# EAGLE design pepper-rev1 (EAGLE 9.3.2)
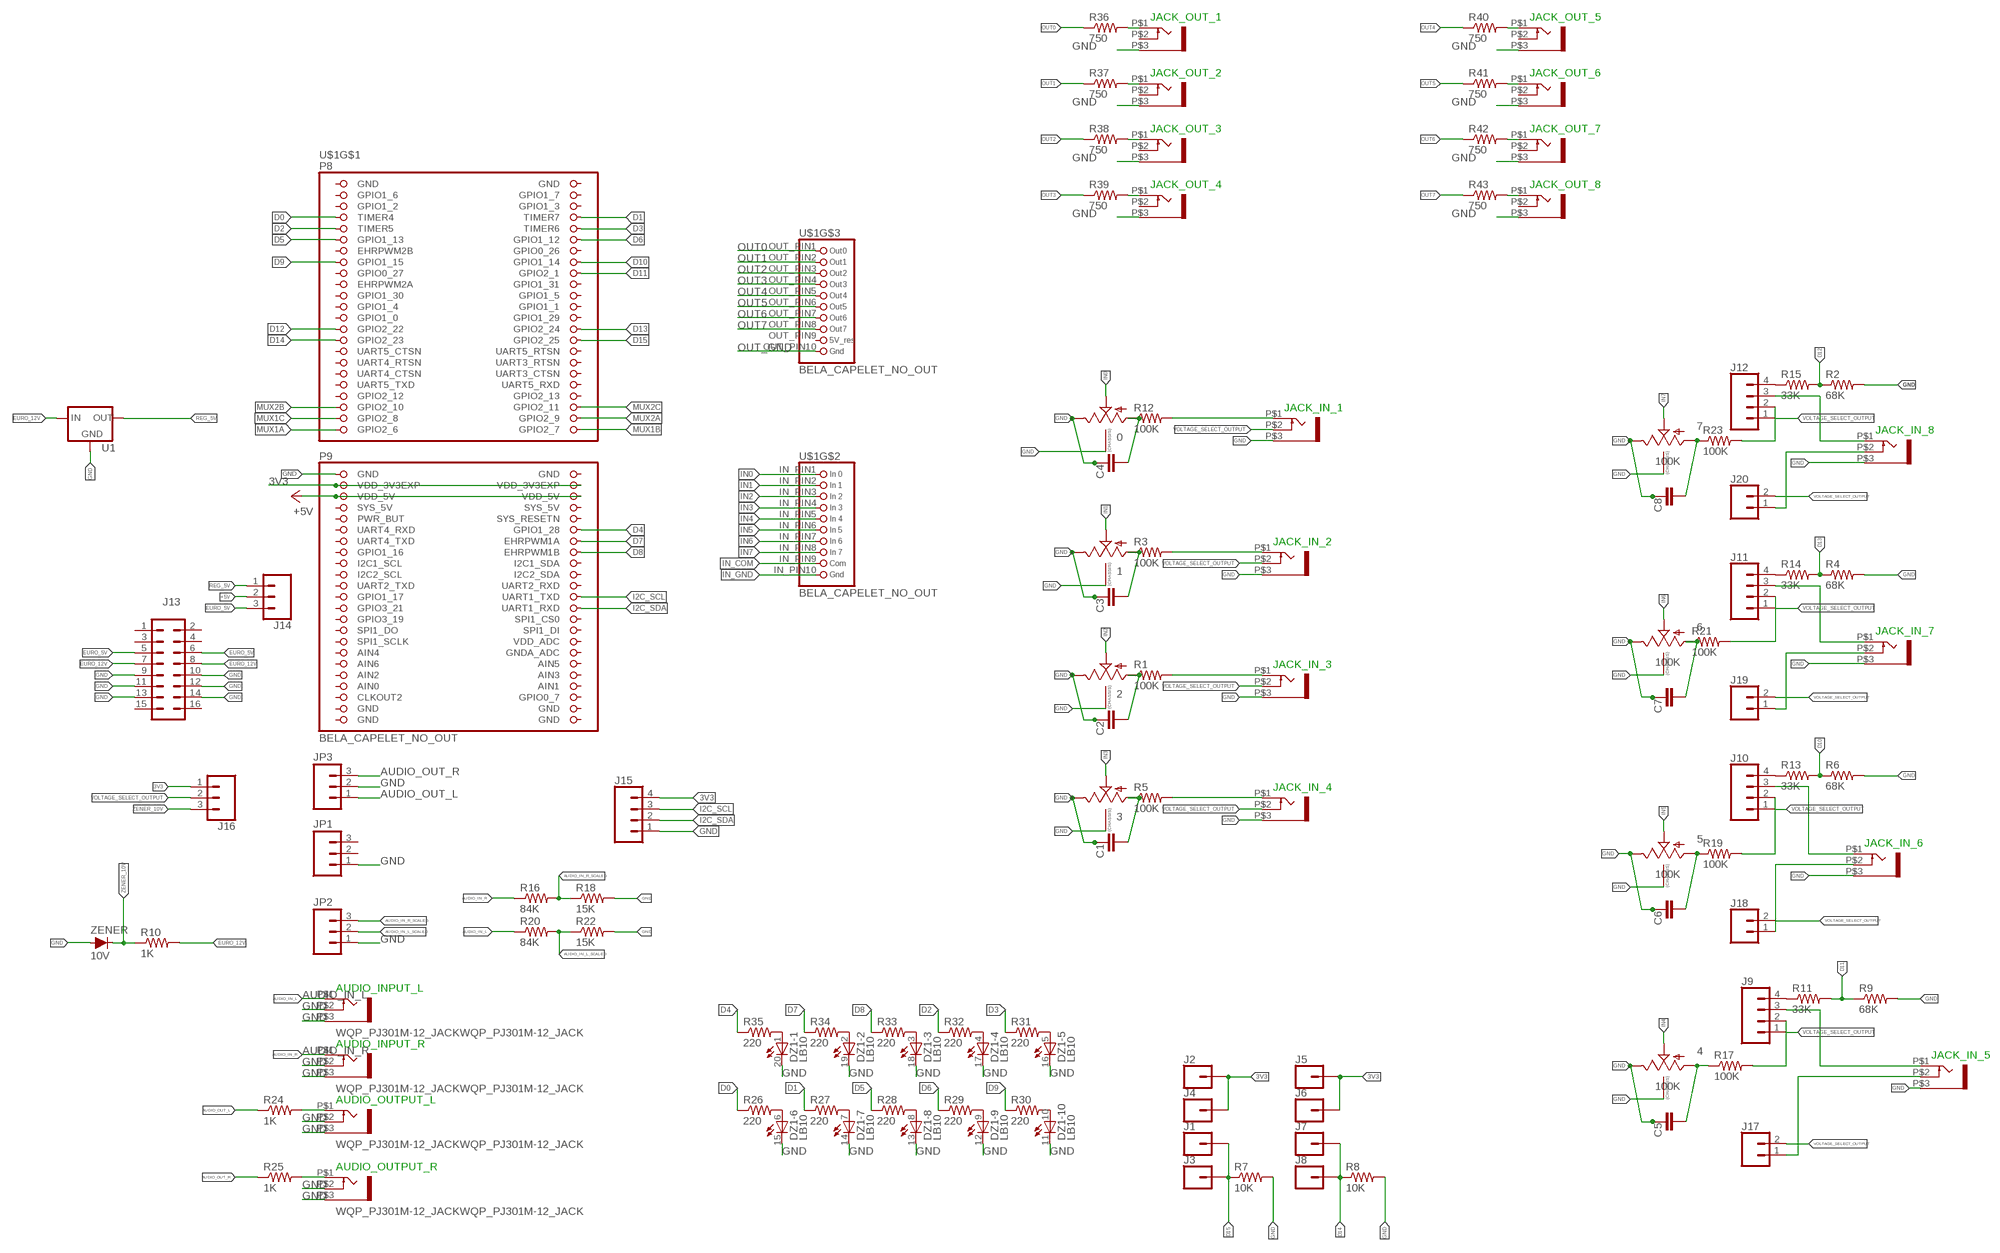
[diagram p0: schematic, sheet 1]

## Parts
0  9MM_SNAP-IN_POT_CHASSIS  [9MM_SNAP-IN_POT]
1  9MM_SNAP-IN_POT_CHASSIS  [9MM_SNAP-IN_POT]
2  9MM_SNAP-IN_POT_CHASSIS  [9MM_SNAP-IN_POT]
3  9MM_SNAP-IN_POT_CHASSIS  [9MM_SNAP-IN_POT]
4  100K  9MM_SNAP-IN_POT_CHASSIS  [9MM_SNAP-IN_POT]
5  100K  9MM_SNAP-IN_POT_CHASSIS  [9MM_SNAP-IN_POT]
6  100K  9MM_SNAP-IN_POT_CHASSIS  [9MM_SNAP-IN_POT]
7  100K  9MM_SNAP-IN_POT_CHASSIS  [9MM_SNAP-IN_POT]
AUDIO_INPUT_L  WQP_PJ301M-12_JACKWQP_PJ301M-12_JACK  [JACK-3.5]
AUDIO_INPUT_R  WQP_PJ301M-12_JACKWQP_PJ301M-12_JACK  [JACK-3.5]
AUDIO_OUTPUT_L  WQP_PJ301M-12_JACKWQP_PJ301M-12_JACK  [JACK-3.5]
AUDIO_OUTPUT_R  WQP_PJ301M-12_JACKWQP_PJ301M-12_JACK  [JACK-3.5]
C1  CAPPTH  [CAP-PTH-SMALL]
C2  CAPPTH  [CAP-PTH-SMALL]
C3  CAPPTH  [CAP-PTH-SMALL]
C4  CAPPTH  [CAP-PTH-SMALL]
C5  CAPPTH  [CAP-PTH-SMALL]
C6  CAPPTH  [CAP-PTH-SMALL]
C7  CAPPTH  [CAP-PTH-SMALL]
C8  CAPPTH  [CAP-PTH-SMALL]
DZ1  LB10  [LB10]
J1  CONN_01  [1X01]
J2  CONN_01  [1X01]
J3  CONN_01  [1X01]
J4  CONN_01  [1X01]
J5  CONN_01  [1X01]
J6  CONN_01  [1X01]
J7  CONN_01  [1X01]
J8  CONN_01  [1X01]
J9  CONN_04PTH  [1X04]
J10  CONN_04PTH  [1X04]
J11  CONN_04PTH  [1X04]
J12  CONN_04PTH  [1X04]
J13  2X6 FEMALE  CONN_08X2  [2X8]
J14  CONN_03  [1X03]
J15  CONN_04PTH  [1X04]
J16  CONN_03  [1X03]
J17  CONN_02  [1X02]
J18  CONN_02  [1X02]
J19  CONN_02  [1X02]
J20  CONN_02  [1X02]
JACK_IN_1  WQP_PJ301M-12_JACKWQP_PJ301M-12_JACK  [JACK-3.5]
JACK_IN_2  WQP_PJ301M-12_JACKWQP_PJ301M-12_JACK  [JACK-3.5]
JACK_IN_3  WQP_PJ301M-12_JACKWQP_PJ301M-12_JACK  [JACK-3.5]
JACK_IN_4  WQP_PJ301M-12_JACKWQP_PJ301M-12_JACK  [JACK-3.5]
JACK_IN_5  WQP_PJ301M-12_JACKWQP_PJ301M-12_JACK  [JACK-3.5]
JACK_IN_6  WQP_PJ301M-12_JACKWQP_PJ301M-12_JACK  [JACK-3.5]
JACK_IN_7  WQP_PJ301M-12_JACKWQP_PJ301M-12_JACK  [JACK-3.5]
JACK_IN_8  WQP_PJ301M-12_JACKWQP_PJ301M-12_JACK  [JACK-3.5]
JACK_OUT_1  WQP_PJ301M-12_JACKWQP_PJ301M-12_JACK  [JACK-3.5]
JACK_OUT_2  WQP_PJ301M-12_JACKWQP_PJ301M-12_JACK  [JACK-3.5]
JACK_OUT_3  WQP_PJ301M-12_JACKWQP_PJ301M-12_JACK  [JACK-3.5]
JACK_OUT_4  WQP_PJ301M-12_JACKWQP_PJ301M-12_JACK  [JACK-3.5]
JACK_OUT_5  WQP_PJ301M-12_JACKWQP_PJ301M-12_JACK  [JACK-3.5]
JACK_OUT_6  WQP_PJ301M-12_JACKWQP_PJ301M-12_JACK  [JACK-3.5]
JACK_OUT_7  WQP_PJ301M-12_JACKWQP_PJ301M-12_JACK  [JACK-3.5]
JACK_OUT_8  WQP_PJ301M-12_JACKWQP_PJ301M-12_JACK  [JACK-3.5]
JP1  M03PTH  [1X03@1]
JP2  M03PTH  [1X03@1]
JP3  M03PTH  [1X03@1]
R1  100K  RESISTORAXIAL-0.3  [AXIAL-0.3]
R2  68K  RESISTORAXIAL-0.3  [AXIAL-0.3]
R3  100K  RESISTORAXIAL-0.3  [AXIAL-0.3]
R4  68K  RESISTORAXIAL-0.3  [AXIAL-0.3]
R5  100K  RESISTORAXIAL-0.3  [AXIAL-0.3]
R6  68K  RESISTORAXIAL-0.3  [AXIAL-0.3]
R7  10K  RESISTORAXIAL-0.3  [AXIAL-0.3]
R8  10K  RESISTORAXIAL-0.3  [AXIAL-0.3]
R9  68K  RESISTORAXIAL-0.3  [AXIAL-0.3]
R10  1K  RESISTORAXIAL-0.3  [AXIAL-0.3]
R11  33K  RESISTORAXIAL-0.3  [AXIAL-0.3]
R12  100K  RESISTORAXIAL-0.3  [AXIAL-0.3]
R13  33K  RESISTORAXIAL-0.3  [AXIAL-0.3]
R14  33K  RESISTORAXIAL-0.3  [AXIAL-0.3]
R15  33K  RESISTORAXIAL-0.3  [AXIAL-0.3]
R16  84K  RESISTORAXIAL-0.3  [AXIAL-0.3]
R17  100K  RESISTORAXIAL-0.3  [AXIAL-0.3]
R18  15K  RESISTORAXIAL-0.3  [AXIAL-0.3]
R19  100K  RESISTORAXIAL-0.3  [AXIAL-0.3]
R20  84K  RESISTORAXIAL-0.3  [AXIAL-0.3]
R21  100K  RESISTORAXIAL-0.3  [AXIAL-0.3]
R22  15K  RESISTORAXIAL-0.3  [AXIAL-0.3]
R23  100K  RESISTORAXIAL-0.3  [AXIAL-0.3]
R24  1K  RESISTORAXIAL-0.3  [AXIAL-0.3]
R25  1K  RESISTORAXIAL-0.3  [AXIAL-0.3]
R26  220  RESISTORAXIAL-0.3  [AXIAL-0.3]
R27  220  RESISTORAXIAL-0.3  [AXIAL-0.3]
R28  220  RESISTORAXIAL-0.3  [AXIAL-0.3]
R29  220  RESISTORAXIAL-0.3  [AXIAL-0.3]
R30  220  RESISTORAXIAL-0.3  [AXIAL-0.3]
R31  220  RESISTORAXIAL-0.3  [AXIAL-0.3]
R32  220  RESISTORAXIAL-0.3  [AXIAL-0.3]
R33  220  RESISTORAXIAL-0.3  [AXIAL-0.3]
R34  220  RESISTORAXIAL-0.3  [AXIAL-0.3]
R35  220  RESISTORAXIAL-0.3  [AXIAL-0.3]
R36  750  RESISTORAXIAL-0.3  [AXIAL-0.3]
R37  750  RESISTORAXIAL-0.3  [AXIAL-0.3]
R38  750  RESISTORAXIAL-0.3  [AXIAL-0.3]
R39  750  RESISTORAXIAL-0.3  [AXIAL-0.3]
R40  750  RESISTORAXIAL-0.3  [AXIAL-0.3]
R41  750  RESISTORAXIAL-0.3  [AXIAL-0.3]
R42  750  RESISTORAXIAL-0.3  [AXIAL-0.3]
R43  750  RESISTORAXIAL-0.3  [AXIAL-0.3]
U1  V_REG_78XXSINK  [TO220-IGO]
U$1  BELA_CAPELET_NO_OUT  [BELA_CAPELET_NO_OUTLINE]
ZENER  10V  DIODE-KIT2  [DIODE-1N4001-KIT]

## Nets
1: JACK_IN_3.P$1 R1.P$2
2: JACK_IN_2.P$1 R3.P$2
3: JACK_IN_1.P$1 R12.P$2
3V3: J2.1 J4.1 J5.1 J6.1 J15.4 J16.1 U$1.49(VDD_3V3EXP) U$1.50(VDD_3V3EXP)
4: JACK_IN_4.P$1 R5.P$2
+5V: J14.2 U$1.51(VDD_5V) U$1.52(VDD_5V)
AUDIO_IN_L: AUDIO_INPUT_L.P$1 R20.P$1
AUDIO_IN_L_SCALED: JP2.2 R20.P$2 R22.P$1
AUDIO_IN_R: AUDIO_INPUT_R.P$1 R16.P$1
AUDIO_IN_R_SCALED: JP2.3 R16.P$2 R18.P$1
AUDIO_OUT_L: JP3.1 R24.P$1
AUDIO_OUT_R: JP3.3 R25.P$1
D0: R26.P$1 U$1.7(TIMER4)
D1: R27.P$1 U$1.8(TIMER7)
D2: R32.P$1 U$1.9(TIMER5)
D3: R31.P$1 U$1.10(TIMER6)
D4: R35.P$1 U$1.58(GPIO1_28)
D5: R28.P$1 U$1.11(GPIO1_13)
D6: R29.P$1 U$1.12(GPIO1_12)
D7: R34.P$1 U$1.60(EHRPWM1A)
D8: R33.P$1 U$1.62(EHRPWM1B)
D9: R30.P$1 U$1.15(GPIO1_15)
D10: R6.P$1 R13.P$2 U$1.16(GPIO1_14)
D11: R9.P$1 R11.P$2 U$1.18(GPIO2_1)
D12: R2.P$1 R15.P$2 U$1.27(GPIO2_22)
D13: R4.P$1 R14.P$2 U$1.28(GPIO2_24)
D14: J7.1 J8.1 R8.P$1 U$1.29(GPIO2_23)
D15: J1.1 J3.1 R7.P$1 U$1.30(GPIO2_25)
EURO_5V: J13.5 J13.6 J14.3
EURO_12V: J13.7 J13.8 R10.P$2 U1.IN
GND: 0.3(E) 0.CHASSIS1 0.CHASSIS2 1.3(E) 1.CHASSIS1 1.CHASSIS2 2.3(E) 2.CHASSIS1 2.CHASSIS2 3.3(E) 3.CHASSIS1 3.CHASSIS2 4.3(E) 4.CHASSIS1 4.CHASSIS2 5.3(E) 5.CHASSIS1 5.CHASSIS2 6.3(E) 6.CHASSIS1 6.CHASSIS2 7.3(E) 7.CHASSIS1 7.CHASSIS2 AUDIO_INPUT_L.P$2 AUDIO_INPUT_L.P$3 AUDIO_INPUT_R.P$2 AUDIO_INPUT_R.P$3 AUDIO_OUTPUT_L.P$2 AUDIO_OUTPUT_L.P$3 AUDIO_OUTPUT_R.P$2 AUDIO_OUTPUT_R.P$3 C1.1 C2.1 C3.1 C4.1 C5.1 C6.1 C7.1 C8.1 DZ1.11(-10:C) DZ1.12(-9:C) DZ1.13(-8:C) DZ1.14(-7:C) DZ1.15(-6:C) DZ1.16(-5:C) DZ1.17(-4:C) DZ1.18(-3:C) DZ1.19(-2:C) DZ1.20(-1:C) J13.9 J13.10 J13.11 J13.12 J13.13 J13.14 J15.1 JACK_IN_1.P$3 JACK_IN_2.P$3 JACK_IN_3.P$3 JACK_IN_4.P$3 JACK_IN_5.P$3 JACK_IN_6.P$3 JACK_IN_7.P$3 JACK_IN_8.P$3 JACK_OUT_1.P$3 JACK_OUT_2.P$3 JACK_OUT_3.P$3 JACK_OUT_4.P$3 JACK_OUT_5.P$3 JACK_OUT_6.P$3 JACK_OUT_7.P$3 JACK_OUT_8.P$3 JP1.1 JP2.1 JP3.2 R2.P$2 R4.P$2 R6.P$2 R7.P$2 R8.P$2 R9.P$2 R18.P$2 R22.P$2 U1.GND U$1.47(GND) ZENER.A
I2C_SCL: J15.3 U$1.70(UART1_TXD)
I2C_SDA: J15.2 U$1.72(UART1_RXD)
IN0: 0.2(S) U$1.IN_PIN1
IN1: 1.2(S) U$1.IN_PIN2
IN2: 2.2(S) U$1.IN_PIN3
IN3: 3.2(S) U$1.IN_PIN4
IN4: 4.2(S) U$1.IN_PIN5
IN5: 5.2(S) U$1.IN_PIN6
IN6: 6.2(S) U$1.IN_PIN7
IN7: 7.2(S) U$1.IN_PIN8
IN_COM: U$1.IN_PIN9
IN_GND: U$1.IN_PIN10
MUX1A: U$1.45(GPIO2_6)
MUX1B: U$1.46(GPIO2_7)
MUX1C: U$1.43(GPIO2_8)
MUX2A: U$1.44(GPIO2_9)
MUX2B: U$1.41(GPIO2_10)
MUX2C: U$1.42(GPIO2_11)
N$2: J10.3 JACK_IN_6.P$1
N$3: DZ1.6(-6:A) R26.P$2
N$4: DZ1.7(-7:A) R27.P$2
N$5: DZ1.8(-8:A) R28.P$2
N$6: DZ1.9(-9:A) R29.P$2
N$7: DZ1.10(-10:A) R30.P$2
N$8: DZ1.5(-5:A) R31.P$2
N$9: DZ1.4(-4:A) R32.P$2
N$10: DZ1.3(-3:A) R33.P$2
N$11: DZ1.2(-2:A) R34.P$2
N$12: DZ1.1(-1:A) R35.P$2
N$13: 1.1(A) C3.2 R3.P$1
N$14: J12.2 R23.P$2
N$15: J11.3 JACK_IN_7.P$1
N$16: 6.1(A) C7.2 R21.P$1
N$17: J9.2 R17.P$2
N$18: 5.1(A) C6.2 R19.P$1
N$19: J9.3 JACK_IN_5.P$1
N$20: J12.3 JACK_IN_8.P$1
N$21: 4.1(A) C5.2 R17.P$1
N$22: J10.4 R13.P$1
N$23: J12.4 R15.P$1
N$24: J9.4 R11.P$1
N$25: J10.2 R19.P$2
N$26: J11.2 R21.P$2
N$27: J11.4 R14.P$1
N$28: AUDIO_OUTPUT_R.P$1 R25.P$2
N$29: AUDIO_OUTPUT_L.P$1 R24.P$2
N$30: J17.1 JACK_IN_5.P$2
N$31: JACK_OUT_1.P$1 R36.P$2
N$32: J19.1 JACK_IN_7.P$2
N$33: J18.1 JACK_IN_6.P$2
N$34: J20.1 JACK_IN_8.P$2
N$35: JACK_OUT_2.P$1 R37.P$2
N$36: JACK_OUT_3.P$1 R38.P$2
N$37: JACK_OUT_4.P$1 R39.P$2
N$38: JACK_OUT_5.P$1 R40.P$2
N$39: JACK_OUT_6.P$1 R41.P$2
N$40: JACK_OUT_7.P$1 R42.P$2
N$41: JACK_OUT_8.P$1 R43.P$2
OUT0: R36.P$1 U$1.OUT_PIN1
OUT1: R37.P$1 U$1.OUT_PIN2
OUT2: R38.P$1 U$1.OUT_PIN3
OUT3: R39.P$1 U$1.OUT_PIN4
OUT4: R40.P$1 U$1.OUT_PIN5
OUT5: R41.P$1 U$1.OUT_PIN6
OUT6: R42.P$1 U$1.OUT_PIN7
OUT7: R43.P$1 U$1.OUT_PIN8
OUT_GND: U$1.OUT_PIN10
POT_IN1: 0.1(A) C4.2 R12.P$1
POT_IN3: 2.1(A) C2.2 R1.P$1
POT_IN4: 3.1(A) C1.2 R5.P$1
POT_IN8: 7.1(A) C8.2 R23.P$1
REG_5V: J14.1 U1.OUT
VOLTAGE_SELECT_OUTPUT: J9.1 J10.1 J11.1 J12.1 J16.2 J17.2 J18.2 J19.2 J20.2 JACK_IN_1.P$2 JACK_IN_2.P$2 JACK_IN_3.P$2 JACK_IN_4.P$2
ZENER_10V: J16.3 R10.P$1 ZENER.C
Unconnected: J13.1 J13.2 J13.3 J13.4 J13.15 J13.16 JACK_OUT_1.P$2 JACK_OUT_2.P$2 JACK_OUT_3.P$2 JACK_OUT_4.P$2 JACK_OUT_5.P$2 JACK_OUT_6.P$2 JACK_OUT_7.P$2 JACK_OUT_8.P$2 JP1.2 JP1.3 U$1.3(GPIO1_6) U$1.4(GPIO1_7) U$1.5(GPIO1_2) U$1.6(GPIO1_3) U$1.13(EHRPWM2B) U$1.14(GPIO0_26) U$1.17(GPIO0_27) U$1.19(EHRPWM2A) U$1.20(GPIO1_31) U$1.21(GPIO1_30) U$1.22(GPIO1_5) U$1.23(GPIO1_4) U$1.24(GPIO1_1) U$1.25(GPIO1_0) U$1.26(GPIO1_29) U$1.31(UART5_CTSN) U$1.32(UART5_RTSN) U$1.33(UART4_RTSN) U$1.34(UART3_RTSN) U$1.35(UART4_CTSN) U$1.36(UART3_CTSN) U$1.37(UART5_TXD) U$1.38(UART5_RXD) U$1.39(GPIO2_12) U$1.40(GPIO2_13) U$1.54(SYS_5V) U$1.55(PWR_BUT) U$1.56(SYS_RESETN) U$1.57(UART4_RXD) U$1.59(UART4_TXD) U$1.61(GPIO1_16) U$1.63(I2C1_SCL) U$1.64(I2C1_SDA) U$1.65(I2C2_SCL) U$1.66(I2C2_SDA) U$1.67(UART2_TXD) U$1.68(UART2_RXD) U$1.69(GPIO1_17) U$1.71(GPIO3_21) U$1.73(GPIO3_19) U$1.74(SPI1_CS0) U$1.75(SPI1_DO) U$1.76(SPI1_DI) U$1.77(SPI1_SCLK) U$1.78(VDD_ADC) U$1.79(AIN4) U$1.80(GNDA_ADC) U$1.81(AIN6) U$1.82(AIN5) U$1.83(AIN2) U$1.84(AIN3) U$1.86(AIN1) U$1.87(CLKOUT2) U$1.88(GPIO0_7) U$1.OUT_PIN9

## Power pins joined to a net without a drawn wire
AIN0: U$1.85(AIN0)
GND: U$1.1(GND) U$1.2(GND) U$1.48(GND) U$1.89(GND) U$1.90(GND) U$1.91(GND) U$1.92(GND)
SYS_5V: U$1.53(SYS_5V)

## Library data of the parts
0 1-7 = MusicThingModular:9MM_SNAP-IN_POT_CHASSIS: 9mm vertical snap-in pot, Alpha / Panasonic style, with a connection to the metal chassis for grounding
AUDIO_INPUT_L AUDIO_INPUT_R AUDIO_OUTPUT_L AUDIO_OUTPUT_R JACK_IN_1-JACK_IN_8 JACK_OUT_1-JACK_OUT_8 = thonkiconn_eagle_v5:WQP_PJ301M-12_JACK: 3.5mm Vertical Jack from Thonk.co.uk
C1-C8 = SparkFun-Capacitors:CAP: Capacitor Standard 0603 ceramic capacitor, and 0.1" leaded capacitor.
DZ1 = led:LB10: LED BLOCK 10-LED bar graph, DIL, Siemens
J1-J8 = SparkFun-Connectors:CONN_01: Single connection point. Often used as Generic Header-pin footprint for 0.1 inch spaced/style header connections On any of the 0.1 inch spaced packages, you can populate with these: Break Away Headers - Straight <https://www.sparkfun.com/products/116> (PRT-00116) Break Away Male Headers - Right Angle <https://www.sparkfun.com/products/553> (PRT-00553) Female Headers <https://www.sparkfun.com/products/115> (PRT-00115) Break Away Headers - Machine Pin <https://www.sparkfun.com/products/117> (PRT-00117) Break Away Female Headers - Swiss Machine Pin <https://www.sparkfun.com/products/743> (PRT-00743) This device is also useful as a general connection point to wire up your design to another part of your project. Our various solder wires solder well into these plated through hole pads. Hook-Up Wire - Assortment (Stranded, 22 AWG) <https://www.sparkfun.com/products/11375> (PRT-11375) Hook-Up Wire - Assortment (Solid Core, 22 AWG) <https://www.sparkfun.com/products/11367> (PRT-11367) View the entire wire category on our website here <https://www.sparkfun.com/categories/141> Special notes: SMTSO-256-ET is a "flush mount" nut for a 4-40 screw. We mostly use this on specialty testbeds; it is a nice way to connect hardware to your PCB at an adjustable hieght. Also note, the SNAP packages are for using a snappable style connector. We sell a baggie of snaps and they are also used on two LilyPad designs: Snap Assortment - 30 pack (male and female) <https://www.sparkfun.com/products/11347> (DEV-11347) LilyPad Arduino SimpleSnap <https://www.sparkfun.com/products/10941> (DEV-10941) LilyPad SimpleSnap Protoboard <https://www.sparkfun.com/products/10940> (DEV-10940)
J9-J12 J15 = SparkFun-Connectors:CONN_04: Multi connection point. Often used as Generic Header-pin footprint for 0.1 inch spaced/style header connections On any of the 0.1 inch spaced packages, you can populate with these: Break Away Headers - Straight <https://www.sparkfun.com/products/116> (PRT-00116) Break Away Male Headers - Right Angle <https://www.sparkfun.com/products/553> (PRT-00553) Female Headers <https://www.sparkfun.com/products/115> (PRT-00115) Break Away Headers - Machine Pin <https://www.sparkfun.com/products/117> (PRT-00117) Break Away Female Headers - Swiss Machine Pin <https://www.sparkfun.com/products/743> (PRT-00743) For SCREWTERMINALS and SPRING TERMINALS visit here: Screw Terimnals on SparkFun.com <https://www.sparkfun.com/search/results?term=Screw+Terminals> (5mm/3.5mm/2.54mm spacing) This device is also useful as a general connection point to wire up your design to another part of your project. Our various solder wires solder well into these plated through hole pads. Hook-Up Wire - Assortment (Stranded, 22 AWG) <https://www.sparkfun.com/products/11375> (PRT-11375) Hook-Up Wire - Assortment (Solid Core, 22 AWG) <https://www.sparkfun.com/products/11367> (PRT-11367) View the entire wire category on our website here <https://www.sparkfun.com/categories/141> Special notes: Molex polarized connector foot print use with SKU : PRT-08231 with associated crimp pins and housings. 1MM SMD Version SKU: PRT-10208; PROD_ID: CONN-09696
J13 = SparkFun-Connectors:CONN_08X2: Multi connection point. Often used as Generic Header-pin footprint for 0.1 inch spaced/style header connections You can populate with any combo of single row headers, but if you'd like an exact match, check this: Header - 2x8 (Male, 0.1") <https://www.sparkfun.com/products/13156> (PRT-13156) On any of the 0.1 inch spaced packages, you can populate with these: Break Away Headers - Straight <https://www.sparkfun.com/products/116> (PRT-00116) Break Away Male Headers - Right Angle <https://www.sparkfun.com/products/553> (PRT-00553) Female Headers <https://www.sparkfun.com/products/115> (PRT-00115) Break Away Headers - Machine Pin <https://www.sparkfun.com/products/117> (PRT-00117) Break Away Female Headers - Swiss Machine Pin <https://www.sparkfun.com/products/743> (PRT-00743)
J14 J16 = SparkFun-Connectors:CONN_03: Multi connection point. Often used as Generic Header-pin footprint for 0.1 inch spaced/style header connections On any of the 0.1 inch spaced packages, you can populate with these: Break Away Headers - Straight <https://www.sparkfun.com/products/116> (PRT-00116) Break Away Male Headers - Right Angle <https://www.sparkfun.com/products/553> (PRT-00553) Female Headers <https://www.sparkfun.com/products/115> (PRT-00115) Break Away Headers - Machine Pin <https://www.sparkfun.com/products/117> (PRT-00117) Break Away Female Headers - Swiss Machine Pin <https://www.sparkfun.com/products/743> (PRT-00743) Stackable Header - 3 Pin (Female, 0.1") <https://www.sparkfun.com/products/13875> (PRT-13875) For SCREWTERMINALS and SPRING TERMINALS visit here: Screw Terimnals on SparkFun.com <https://www.sparkfun.com/search/results?term=Screw+Terminals> (5mm/3.5mm/2.54mm spacing) This device is also useful as a general connection point to wire up your design to another part of your project. Our various solder wires solder well into these plated through hole pads. Hook-Up Wire - Assortment (Stranded, 22 AWG) <https://www.sparkfun.com/products/11375> (PRT-11375) Hook-Up Wire - Assortment (Solid Core, 22 AWG) <https://www.sparkfun.com/products/11367> (PRT-11367) View the entire wire category on our website here <https://www.sparkfun.com/categories/141> Special notes: Molex polarized connector foot print use with SKU : PRT-08232 with associated crimp pins and housings.; PROD_ID: XXX-00000; VALUE: 455-1750-1-ND
J17-J20 = SparkFun-Connectors:CONN_02: Multi connection point. Often used as Generic Header-pin footprint for 0.1 inch spaced/style header connections On any of the 0.1 inch spaced packages, you can populate with these: Break Away Headers - Straight <https://www.sparkfun.com/products/116> (PRT-00116) Break Away Male Headers - Right Angle <https://www.sparkfun.com/products/553> (PRT-00553) Female Headers <https://www.sparkfun.com/products/115> (PRT-00115) Break Away Headers - Machine Pin <https://www.sparkfun.com/products/117> (PRT-00117) Break Away Female Headers - Swiss Machine Pin <https://www.sparkfun.com/products/743> (PRT-00743) For SCREWTERMINALS and SPRING TERMINALS visit here: Screw Terimnals on SparkFun.com <https://www.sparkfun.com/search/results?term=Screw+Terminals> (5mm/3.5mm/2.54mm spacing) This device is also useful as a general connection point to wire up your design to another part of your project. Our various solder wires solder well into these plated through hole pads. Hook-Up Wire - Assortment (Stranded, 22 AWG) <https://www.sparkfun.com/products/11375> (PRT-11375) Hook-Up Wire - Assortment (Solid Core, 22 AWG) <https://www.sparkfun.com/products/11367> (PRT-11367) View the entire wire category on our website here <https://www.sparkfun.com/categories/141> Special notes: Molex polarized connector foot print use with: PRT-08233 with associated crimp pins and housings. 2.54_SCREWTERM for use with PRT-10571. 3.5mm Screw Terminal footprints for PRT-08084 5mm Screw Terminal footprints for use with PRT-08432
JP1-JP3 = SparkFun-Connectors:M03: Header 3 Standard 3-pin 0.1" header. Use with straight break away headers (SKU : PRT-00116), right angle break away headers (PRT-00553), swiss pins (PRT-00743), machine pins (PRT-00117), and female headers (PRT-00115). Molex polarized connector foot print use with SKU : PRT-08232 with associated crimp pins and housings.
R1-R43 = SparkFun-Resistors:RESISTOR: Generic Resistor Package
U1 = SparkFun-IC-Power:V_REG_78XX: Voltage Regulator Standard 78xx regulator. IGO (Input Ground Output). Spark Fun Electronics SKU : COM-00107
U$1 = custom:BELA_CAPELET: Should match A3 pinout - but not completely tested
ZENER = SparkFun-DiscreteSemi:DIODE: Diode These are standard reverse protection diodes and small signal diodes. SparkFun Products: SparkFun SparkPunk Sound Kit <https://www.sparkfun.com/products/11177> SparkFun ESP8266 Thing <https://www.sparkfun.com/products/13231>; PROD_ID: DIO-09176; VALUE: 1A/50V/1.1V

## Board
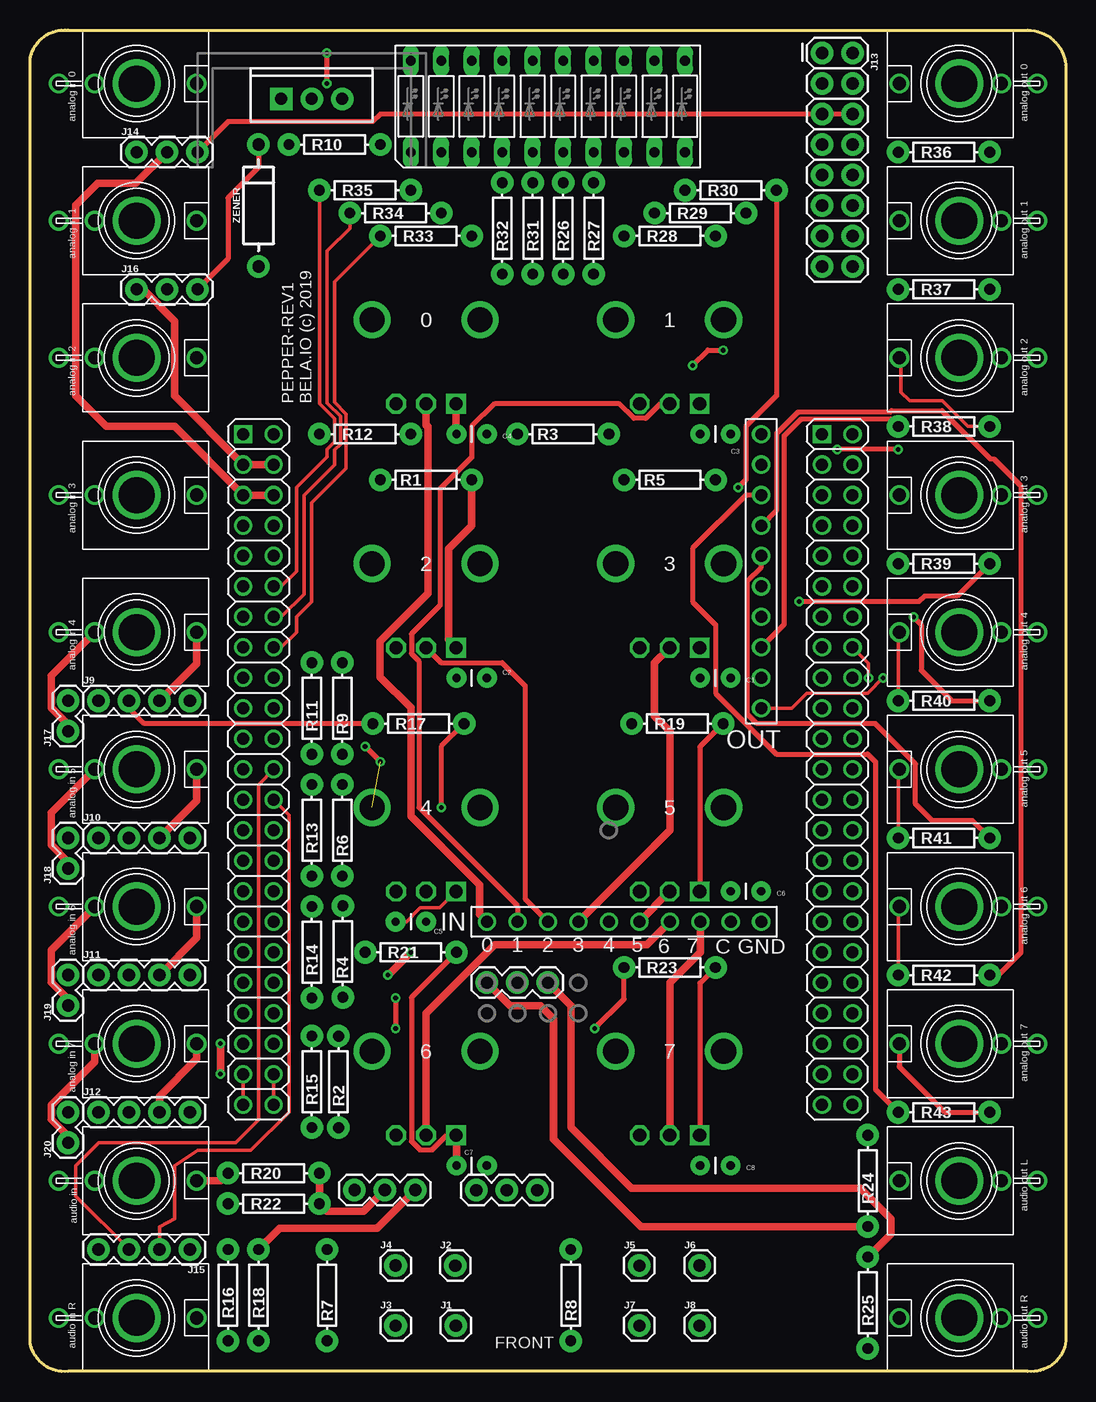
[diagram p1: board, top side]
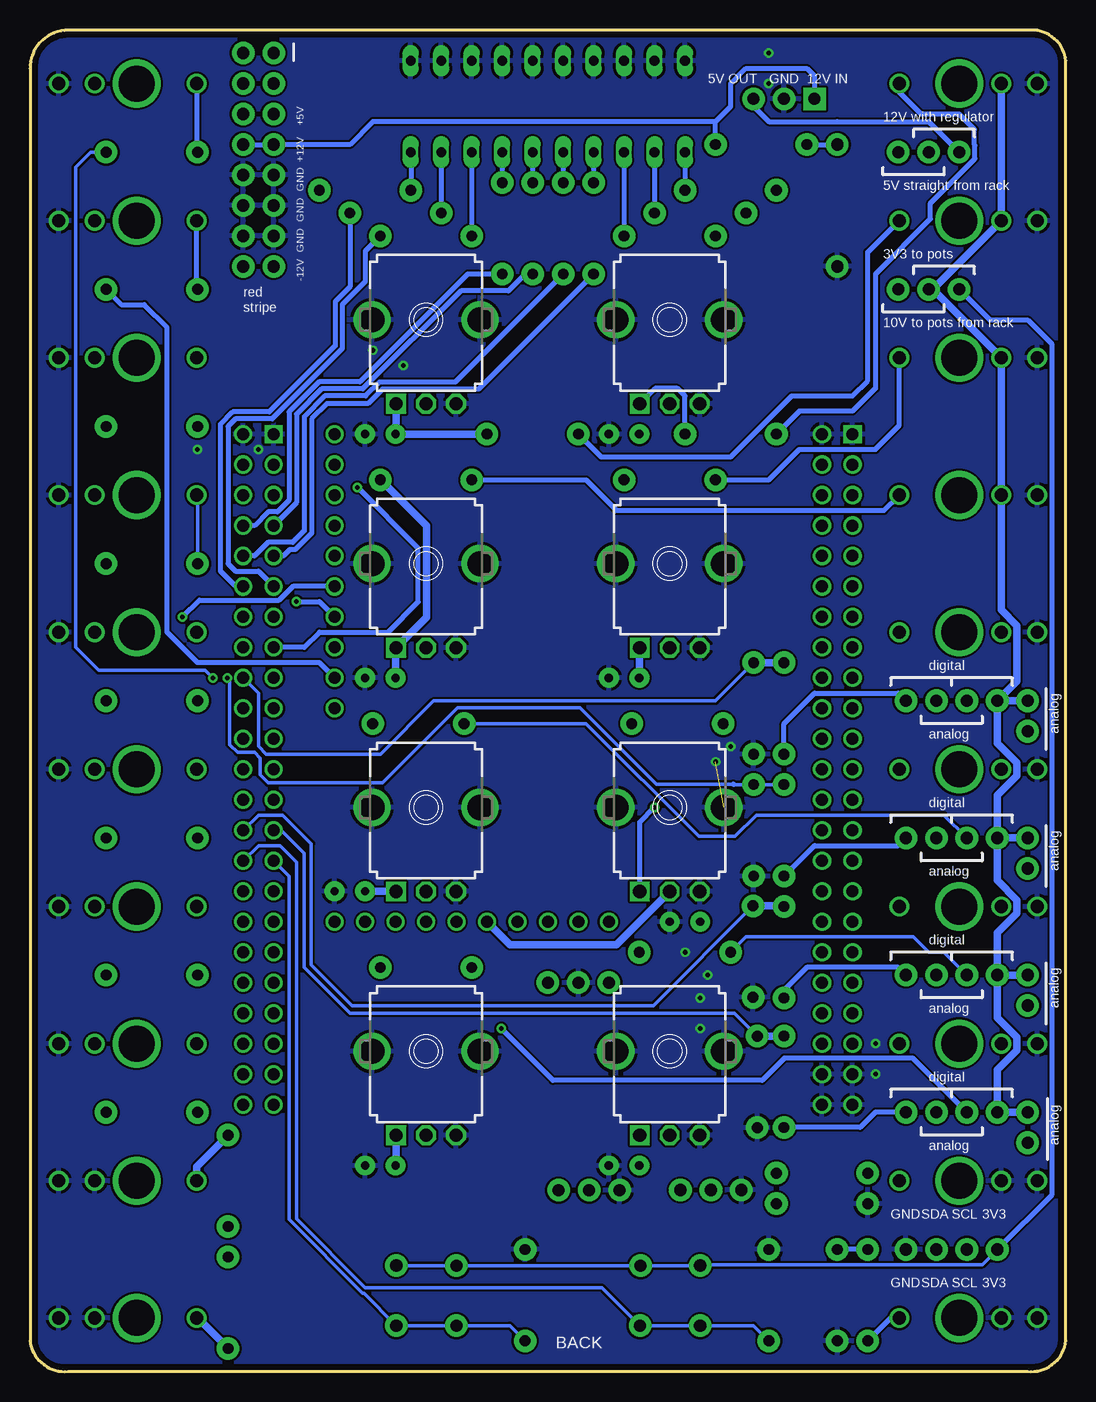
[diagram p2: board, bottom side, seen from below]

Size 86.36 x 111.79 mm. Coordinates in mm from the lower left corner, seen from the top.
Outline: 0,109.24 arc-90 3.18,111.78 83.19,111.78 arc-90 86.36,108.6 86.36,2.56 arc-90 83.19,0.02 3.18,0.02 arc-90 0,2.56 0,109.24
Copper layers (1*16): Top 0.035mm / dielectric 1.5mm / Bottom 0.035mm
Design rules "default *": minimum track width 7mil, minimum drill 15mil, track to track 7mil, track to pad 7mil, pad to pad 7mil, via to via 7mil, smd to smd 0mil, copper to edge 20mil, drill to drill 8mil, minimum pad ring 10mil, minimum via ring 8mil, stop-mask expansion 4mil, vias tented up to drill 20mil, thermal gap 10mil

### Footprints (pad centres in the part's own frame; a part is rotated, then mirrored left to right if it is on the bottom)
9MM_SNAP-IN_POT = drill 1.1 square: 1 -2.5,-7 | drill 1.1 octagon: 2 0,-7; 3 2.5,-7 | drill 2.1 pad 2.794: CHASSIS1 -4.5,0; CHASSIS2 4.5,0
JACK-3.5 = drill 1.1: P$1 0,5; P$2 0,-3.5; P$3 0,-6.5 | drill 3: P$4 0,0
CAP-PTH-SMALL = drill 0.7 pad 1.651: 1 0,0; 2 2.54,0
LB10 = drill 0.813 long: 1 -11.43,-3.81; 2 -8.89,-3.81; 3 -6.35,-3.81; 4 -3.81,-3.81; 5 -1.27,-3.81; 6 1.27,-3.81; 7 3.81,-3.81; 8 6.35,-3.81; 9 8.89,-3.81; 10 11.43,-3.81; 11 11.43,3.81; 12 8.89,3.81; 13 6.35,3.81; 14 3.81,3.81; 15 1.27,3.81; 16 -1.27,3.81; 17 -3.81,3.81; 18 -6.35,3.81; 19 -8.89,3.81; 20 -11.43,3.81
1X01 = drill 1.016 pad 1.88: 1 0,0
1X04 = drill 1.016 pad 1.88: 1 0,0; 2 2.54,0; 3 5.08,0; 4 7.62,0
2X8 = drill 1.016 pad 1.88: 1 0,0; 2 0,2.54; 3 2.54,0; 4 2.54,2.54; 5 5.08,0; 6 5.08,2.54; 7 7.62,0; 8 7.62,2.54; 9 10.16,0; 10 10.16,2.54; 11 12.7,0; 12 12.7,2.54; 13 15.24,0; 14 15.24,2.54; 15 17.78,0; 16 17.78,2.54
1X03 = drill 1.016 pad 1.88: 1 0,0; 2 2.54,0; 3 5.08,0
1X02 = drill 1.016 pad 1.88: 1 0,0; 2 2.54,0
1X03@1 = drill 1.016 pad 1.88: 1 0,0; 2 2.54,0; 3 5.08,0
AXIAL-0.3 = drill 0.9 pad 1.88: P$1 -3.81,0; P$2 3.81,0
TO220-IGO = drill 1 pad 1.88: GND 0,0; OUT 2.54,0 | drill 1 pad 1.88 square: IN -2.54,0
BELA_CAPELET_NO_OUTLINE = drill 1 square: 1 -20.32,-31.75; 47 27.94,-31.75 | drill 1: 2 -22.86,-31.75; 3 -20.32,-29.21; 4 -22.86,-29.21; 5 -20.32,-26.67; 6 -22.86,-26.67; 7 -20.32,-24.13; 8 -22.86,-24.13; 9 -20.32,-21.59; 10 -22.86,-21.59; 11 -20.32,-19.05; 12 -22.86,-19.05; 13 -20.32,-16.51; 14 -22.86,-16.51; 15 -20.32,-13.97; 16 -22.86,-13.97; 17 -20.32,-11.43; 18 -22.86,-11.43; 19 -20.32,-8.89; 20 -22.86,-8.89; 21 -20.32,-6.35; 22 -22.86,-6.35; 23 -20.32,-3.81; 24 -22.86,-3.81; 25 -20.32,-1.27; 26 -22.86,-1.27; 27 -20.32,1.27; 28 -22.86,1.27; 29 -20.32,3.81; 30 -22.86,3.81; 31 -20.32,6.35; 32 -22.86,6.35; 33 -20.32,8.89; 34 -22.86,8.89; 35 -20.32,11.43; 36 -22.86,11.43; 37 -20.32,13.97; 38 -22.86,13.97; 39 -20.32,16.51; 40 -22.86,16.51; 41 -20.32,19.05; 42 -22.86,19.05; 43 -20.32,21.59; 44 -22.86,21.59; 45 -20.32,24.13; 46 -22.86,24.13; 48 25.4,-31.75; 49 27.94,-29.21; 50 25.4,-29.21; 51 27.94,-26.67; 52 25.4,-26.67; 53 27.94,-24.13; 54 25.4,-24.13; 55 27.94,-21.59; 56 25.4,-21.59; 57 27.94,-19.05; 58 25.4,-19.05; 59 27.94,-16.51; 60 25.4,-16.51; 61 27.94,-13.97; 62 25.4,-13.97; 63 27.94,-11.43; 64 25.4,-11.43; 65 27.94,-8.89; 66 25.4,-8.89; 67 27.94,-6.35; 68 25.4,-6.35; 69 27.94,-3.81; 70 25.4,-3.81; 71 27.94,-1.27; 72 25.4,-1.27; 73 27.94,1.27; 74 25.4,1.27; 75 27.94,3.81; 76 25.4,3.81; 77 27.94,6.35; 78 25.4,6.35; 79 27.94,8.89; 80 25.4,8.89; 81 27.94,11.43; 82 25.4,11.43; 83 27.94,13.97; 84 25.4,13.97; 85 27.94,16.51; 86 25.4,16.51; 87 27.94,19.05; 88 25.4,19.05; 89 27.94,21.59; 90 25.4,21.59; 91 27.94,24.13; 92 25.4,24.13; IN_PIN1 7.62,8.89; IN_PIN2 5.08,8.89; IN_PIN3 2.54,8.89; IN_PIN4 0,8.89; IN_PIN5 -2.54,8.89; IN_PIN6 -5.08,8.89; IN_PIN7 -7.62,8.89; IN_PIN8 -10.16,8.89; IN_PIN9 -12.7,8.89; IN_PIN10 -15.24,8.89; OUT_PIN1 -15.24,-8.89; OUT_PIN2 -15.24,-11.43; OUT_PIN3 -15.24,-13.97; OUT_PIN4 -15.24,-16.51; OUT_PIN5 -15.24,-19.05; OUT_PIN6 -15.24,-21.59; OUT_PIN7 -15.24,-24.13; OUT_PIN8 -15.24,-26.67; OUT_PIN9 -15.24,-29.21; OUT_PIN10 -15.24,-31.75
DIODE-1N4001-KIT = drill 1.016 pad 1.88: A -5.08,0; C 5.08,0

### Placement (x,y rotation side)
0  33.02,87.65 0 bottom
1  53.34,87.65 0 bottom
2  33.02,67.33 0 bottom
3  53.34,67.33 0 bottom
4  33.02,47.01 0 bottom
5  53.34,47.01 0 bottom
6  33.02,26.69 0 bottom
7  53.34,26.69 0 bottom
AUDIO_INPUT_L  8.89,15.89 270 top
AUDIO_INPUT_R  8.89,4.46 270 top
AUDIO_OUTPUT_L  77.47,15.89 90 top
AUDIO_OUTPUT_R  77.47,4.46 90 top
C1  58.42,57.8 180 top
C2  38.1,57.8 180 top
C3  58.42,78.12 180 top
C4  38.1,78.12 180 top
C5  33.02,37.48 180 top
C6  60.96,40.02 180 top
C7  38.1,17.16 180 top
C8  58.42,17.16 180 top
DZ1  43.18,105.43 0 top
J1  35.5,3.83 0 top
J2  35.46,8.83 0 top
J3  30.48,3.83 0 top
J4  30.48,8.84 0 top
J5  50.8,8.83 0 top
J6  55.83,8.83 0 top
J7  50.8,3.83 0 top
J8  55.83,3.83 0 top
J9  5.71,55.9 0 top
J10  5.71,44.47 0 top
J11  5.71,33.04 0 top
J12  5.71,21.61 0 top
J13  66.04,109.87 270 top
J14  8.89,101.62 0 top
J15  13.34,10.18 180 top
J16  8.89,90.19 0 top
J17  3.18,53.36 90 top
J18  3.18,41.93 90 top
J19  3.18,30.5 90 top
J20  3.18,19.07 90 top
JACK_IN_1  8.89,107.33 270 top
JACK_IN_2  8.89,95.9 270 top
JACK_IN_3  8.89,84.47 270 top
JACK_IN_4  8.89,73.04 270 top
JACK_IN_5  8.89,61.61 270 top
JACK_IN_6  8.89,50.18 270 top
JACK_IN_7  8.89,38.75 270 top
JACK_IN_8  8.89,27.32 270 top
JACK_OUT_1  77.47,107.33 90 top
JACK_OUT_2  77.47,95.9 90 top
JACK_OUT_3  77.47,84.47 90 top
JACK_OUT_4  77.47,73.04 90 top
JACK_OUT_5  77.47,61.61 90 top
JACK_OUT_6  77.47,50.18 90 top
JACK_OUT_7  77.47,38.75 90 top
JACK_OUT_8  77.47,27.32 90 top
JP1  37.21,15.12 0 top
JP2  27.05,15.13 0 top
JP3  38.1,32.4 0 top
R1  33.02,74.31 180 top
R2  25.72,24.14 270 top
R3  44.45,78.12 180 top
R4  26.08,35 270 top
R5  53.34,74.31 180 top
R6  26.04,45.1 270 top
R7  24.76,6.37 90 top
R8  45.08,6.37 90 top
R9  26.04,55.26 270 top
R10  25.4,102.25 0 top
R11  23.5,55.26 90 top
R12  27.94,78.12 180 top
R13  23.5,45.1 90 top
R14  23.5,34.94 90 top
R15  23.5,24.15 90 top
R16  16.51,6.37 90 top
R17  32.39,53.99 180 top
R18  19.05,6.37 270 top
R19  53.98,53.99 180 top
R20  20.32,16.53 0 top
R21  31.75,34.94 180 top
R22  20.32,13.99 180 top
R23  53.34,33.67 180 top
R24  69.85,15.89 90 top
R25  69.85,5.73 270 top
R26  44.45,95.27 90 top
R27  46.99,95.27 90 top
R28  53.34,94.63 180 top
R29  55.88,96.54 180 top
R30  58.42,98.44 180 top
R31  41.91,95.27 90 top
R32  39.37,95.27 90 top
R33  33.02,94.63 0 top
R34  30.48,96.54 0 top
R35  27.94,98.44 0 top
R36  76.2,101.62 180 top
R37  76.2,90.19 180 top
R38  76.2,78.76 0 top
R39  76.2,67.33 180 top
R40  76.2,55.9 180 top
R41  76.2,44.47 180 top
R42  76.2,33.04 180 top
R43  76.2,21.61 0 top
U1  23.5,106.06 0 top
U$1  45.72,46.37 180 top
ZENER  19.05,97.17 90 top

### Tracks (layer width: path | path; a pad name or v marks a point on that pad's centre or on a via)
1
  Bottom 0.406: R1.P$2 24.76,74.31 22.22,76.85 15.88,76.85 13.89,78.84 JACK_IN_3.P$1
2
  Bottom 0.406: JACK_IN_2.P$1 16.51,93.28 16.51,82.57 17.78,81.3 22.86,81.3 27.94,76.22 38.73,76.22 R3.P$2
3
  Bottom 0.406: JACK_IN_1.P$1 13.89,106.62 12.07,104.79 8.89,104.79 7.62,103.52 7.62,102.22 7.57,102.16 7.57,101.07 11.28,97.36 11.28,96.05 15.88,91.46 15.88,81.93 17.78,80.03 22.22,80.03 R12.P$2
3V3
  Top 0.61: U$1.50 U$1.49 12.07,81.3 12.07,87.54 9.42,90.19 J16.1
  Bottom 0.305: J15.4 6.98,8.91 30.41,8.91 J4.1 30.49,8.83 J2.1 J5.1 J6.1
  Bottom 0.406: J16.1 6.35,87.65 3.18,87.65 1.18,85.66 1.18,14.71 J15.4
4
  Bottom 0.406: R5.P$2 40,74.31 37.47,71.77 15.16,71.77 JACK_IN_4.P$1
+5V
  Top 0.61: U$1.52 U$1.51 12.07,78.76 6.35,78.76 3.81,81.3 3.81,97.17 5.64,99.01 8.82,99.01 J14.2
AUDIO_IN_L
  Top 0.61: AUDIO_INPUT_L.P$1 15.88,15.89 R20.P$1
AUDIO_IN_L_SCALED
  Top 0.61: JP2.2 27.81,13.35 24.76,13.35 R22.P$1 R20.P$2
AUDIO_IN_R
  Bottom 0.406: R16.P$1 14.61,4.46 AUDIO_INPUT_R.P$1
AUDIO_IN_R_SCALED
  Top 0.61: JP2.3 28.96,11.96 20.83,11.96 R18.P$1
  Bottom 0.406: R16.P$2 R18.P$1
AUDIO_OUT_L
  Top 0.61: JP3.1 40,30.5 42.55,30.5 43.66,29.38 43.66,19.38 50.96,12.08 R24.P$1
AUDIO_OUT_R
  Top 0.61: JP3.3 45.08,30.5 45.08,20.34 50.17,15.26 69.22,15.26 71.76,12.72 71.76,11.45 R25.P$1
D0
  Bottom 0.406: R26.P$1 45.08,91.46 46.48,90.06 50.44,90.06 58.62,81.88 62.03,81.88 64.14,79.77 64.14,72.41 U$1.7
D1
  Bottom 0.406: U$1.8 67.65,70.5 66.51,71.64 65.73,71.64 64.77,72.6 64.77,79.97 62.27,82.47 58.86,82.47 49.87,91.46 R27.P$1
D2
  Bottom 0.406: R32.P$1 48.96,81.87 56.98,81.87 58.18,80.66 61.59,80.66 62.87,79.39 62.87,69.87 64.24,68.5 64.7,68.5 65.23,67.96 U$1.9
D3
  Bottom 0.406: R31.P$1 50.92,82.45 57.22,82.45 58.38,81.3 61.79,81.3 63.5,79.58 63.5,70.06 64.46,69.1 66.51,69.1 67.65,67.96 U$1.10
D4
  Top 0.305: U$1.58 20.95,65.42 22.22,66.69 22.22,73.68 24.76,76.22 24.76,76.85 25.4,77.49 25.4,79.39 24.13,80.66 R35.P$1
D5
  Bottom 0.406: U$1.11 67.31,66.69 69.22,66.69 69.85,67.33 69.85,78.76 69.22,79.39 66.17,79.39 60.33,85.24 60.33,88.92 58.42,90.82 58.42,93.36 R28.P$1
D6
  Bottom 0.406: R29.P$1 59.69,90.38 60.91,89.16 60.91,85.48 66.41,79.98 69.46,79.98 70.48,78.95 70.48,66.69 69.22,65.42 U$1.12
D7
  Top 0.305: U$1.60 20.95,62.88 22.86,64.79 22.86,73.04 25.4,75.58 25.4,76.81 25.88,77.29 25.88,79.59 24.79,80.69 24.79,93.39 26.67,95.27 R34.P$1
D8
  Top 0.305: U$1.62 20.95,60.34 22.22,61.61 22.22,62.88 23.5,64.15 23.5,72.41 26.36,75.28 26.36,79.79 25.4,80.76 25.4,90.82 R33.P$1
D9  (via drill 0.38)
  Top 0.406: R30.P$1 62.23,81.3 59.69,78.76 59.69,74.31 v59.06,73.68
  Bottom 0.406: U$1.15 63.5,60.34 62.23,61.61 56.52,61.61 53.99,64.14 53.99,68.61 v59.06,73.68
D10  (via drill 0.38)
  Top 0.305: v69.91,57.8 69.91,59.02 U$1.16
  Bottom 0.305: 69.72,57.67 69.72,52.25 69.05,51.59 67.64,51.59 67.17,51.13 67.17,49.71 66.51,49.05 56.98,49.05 50.71,55.31 40.5,55.31 34.13,48.95 27.72,48.95 | 27.68,48.91 R6.P$1 R13.P$2
  Bottom 0.406: 69.72,57.67 69.85,57.8 v69.91,57.8 | 27.68,48.91 27.72,48.95
D11
  Bottom 0.305: U$1.18 67.31,56.53 67.31,52.09 66.67,51.45 57.15,51.45 52.7,55.9 29.21,55.9 R9.P$1
  Bottom 0.61: R11.P$2 R9.P$1
D12
  Bottom 0.305: R2.P$1 27.64,29.86 59.69,29.86 63.5,33.67 63.5,43.2 65.41,45.1 U$1.27
  Bottom 0.61: R15.P$2 R2.P$1
D13
  Bottom 0.305: R4.P$1 34.39,30.5 59.5,30.5 62.92,33.91 62.92,43.99 65.3,46.37 67.31,46.37 U$1.28
  Bottom 0.61: R4.P$1 23.56,38.81 R14.P$2
D14
  Bottom 0.305: J8.1 46.36,3.83 R8.P$1 | J7.1 J8.1 | J8.1 58.52,6.52 58.62,6.52 64.77,12.67 64.77,41.29 U$1.29
D15
  Bottom 0.305: R7.P$1 26.04,3.83 J3.1 J1.1 38.67,7 58.42,7 64.14,12.72 64.14,42.44 65.52,43.83 67.31,43.83 U$1.30
EURO_5V
  Top 0.406: J14.3 16.51,104.16 28.57,104.16 29.21,104.79 J13.5 J13.6
EURO_12V
  Bottom 0.406: R10.P$2 29.21,104.16 | 29.21,104.16 57.78,104.16 59.69,102.25 J13.7 J13.8 | 29.21,104.16 27.94,105.43 27.94,107.33 26.67,108.6 21.59,108.6 20.95,107.97 U1.IN
GND  (via drill 0.38)  (1 unrouted)
  Top 0.305: U$1.89 U$1.91 | U$1.90 U$1.92
  Top 0.406: v55.25,83.84 56.52,85.11 v57.78,85.11 | v30.48,31.13 v30.48,28.59 | v24.76,107.33 v24.76,109.87 | v72.39,76.85 v67.31,76.85 | v27.94,52.09 v29.21,50.82
  Top 0.61: v31.75,34.94 v29.85,33.04 | v15.88,27.32 v15.88,24.78
  pour Bottom: 0,108.6 arc-90 3.18,111.78 82.55,111.78 arc-90 86.36,107.97 86.36,2.56 arc-90 83.82,0.02 2.54,0.02 arc-90 0,2.56
I2C_SCL
  Top 0.305: U$1.70 19.05,48.91 19.05,20.97 17.14,19.07 5.71,19.07 3.81,17.16 3.81,14.62 J15.3
I2C_SDA
  Top 0.305: J15.2 10.79,12.08 12.07,12.72 12.07,17.16 13.97,18.43 18.41,18.43 21.59,21.61 21.59,46.37 U$1.72
IN0
  Top 0.61: 0.2 33.02,78.86 33.17,78.71 33.17,64.85 29.2,60.87 29.2,57.88 31.75,55.32 31.75,46.28 37.48,40.55 37.48,38.11 U$1.IN_PIN1
IN1
  Top 0.406: 1.2 52.56,80.65 51.34,79.43 50.33,79.43 49.12,80.65 38.72,80.65 36.83,78.76 36.83,76.18 34.2,73.55 34.2,63.87 31.8,61.47 31.8,59.82 32.44,59.19 32.44,47.01 40.64,38.8 U$1.IN_PIN2
IN2
  Top 0.406: 2.2 34.28,59.07 39.37,59.07 41.28,57.17 41.28,39.39 U$1.IN_PIN3
IN3
  Top 0.61: U$1.IN_PIN4 53.34,45.1 53.34,53.36 52.07,54.63 52.07,59.06 3.2
IN4
  Bottom 0.61: 4.2 37.45,35.58 46.36,35.58 U$1.IN_PIN5
IN5
  Top 0.61: 5.2 53.33,40.01 U$1.IN_PIN6
IN6
  Top 0.61: U$1.IN_PIN7 51.44,35.58 38.73,35.58 33.02,29.86 6.2
IN7
  Top 0.61: U$1.IN_PIN8 55.88,34.94 53.34,32.4 7.2
N$2
  Top 0.61: JACK_IN_6.P$1 13.89,47.56 J10.3
N$3
  Bottom 0.406: DZ1.6 R26.P$2
N$4
  Bottom 0.406: DZ1.7 R27.P$2
N$5
  Bottom 0.406: DZ1.8 R28.P$2
N$6
  Bottom 0.406: DZ1.9 R29.P$2
N$7
  Bottom 0.406: DZ1.10 R30.P$2
N$8
  Bottom 0.406: DZ1.5 R31.P$2
N$9
  Bottom 0.406: DZ1.4 R32.P$2
N$10
  Bottom 0.406: DZ1.3 R33.P$2
N$11
  Bottom 0.406: DZ1.2 R34.P$2
N$12
  Bottom 0.406: DZ1.1 R35.P$2
N$13
  Bottom 0.61: R3.P$1 C3.2 55.84,78.16 1.1
N$14  (via drill 0.38)
  Top 0.406: v47.08,28.59 49.53,31.04 R23.P$2
  Bottom 0.406: J12.2 12.76,26.12 23.47,26.12 25.31,24.27 42.76,24.27 v47.08,28.59
N$15
  Top 0.61: JACK_IN_7.P$1 13.89,36.13 J11.3
N$16
  Top 0.406: 6.1 34.74,19.69 33.53,18.47 32.52,18.47 31.8,19.18 31.8,31.18 R21.P$1
  Top 0.61: C7.2 35.56,19.65 6.1
N$17
  Top 0.406: R17.P$2 9.52,53.99 8.25,55.26 J9.2
N$18
  Top 0.406: R19.P$1 55.84,52.05 5.1
  Bottom 0.61: 5.1 58.41,40.01 C6.2
N$19
  Top 0.61: JACK_IN_5.P$1 13.89,58.99 J9.3
N$20
  Top 0.61: JACK_IN_8.P$1 13.89,26.05 10.79,22.96 J12.3
N$21  (via drill 0.38)
  Top 0.305: 4.1 34.15,38.64 32.54,38.64 31.39,37.48 C5.2
  Top 0.406: R17.P$1 34.29,52.09 v34.29,47.01
  Bottom 0.406: 4.1 35.52,45.78 v34.29,47.01
N$22
  Bottom 0.406: J10.4 13.97,43.83 20.95,43.83 R13.P$1
N$23
  Bottom 0.406: J12.4 15.88,21.61 17.14,20.34 R15.P$1
N$24
  Bottom 0.406: R11.P$1 23.5,53.99 20.95,56.53 13.97,56.53 J9.4
N$25
  Bottom 0.305: J10.2 10.16,46.37 25.82,46.37 27.6,44.59 30.6,44.59 40,53.99 R19.P$2
N$26
  Bottom 0.305: J11.2 10.16,34.94 11.43,34.94 12.7,36.21 26.67,36.21 R21.P$2
N$27
  Bottom 0.406: J11.4 13.97,33.67 21.59,33.67 23.5,31.77 R14.P$1
N$28
  Bottom 0.61: R25.P$2 72.39,4.46 AUDIO_OUTPUT_R.P$1
N$29
  Bottom 0.61: R24.P$2 72.47,17.08 AUDIO_OUTPUT_L.P$1
N$30
  Top 0.61: J17.1 3.18,53.89 1.75,55.31 1.75,57.98 JACK_IN_5.P$2
N$31
  Bottom 0.406: JACK_OUT_1.P$1 72.47,101.7 R36.P$2
N$32
  Top 0.61: J19.1 3.18,31.03 1.75,32.45 1.75,35.12 JACK_IN_7.P$2
N$33
  Top 0.61: J18.1 3.18,42.46 1.75,43.88 1.75,46.55 JACK_IN_6.P$2
N$34
  Top 0.61: JACK_IN_8.P$2 5.39,25.83 1.75,22.2 1.75,21.02 3.18,19.6 J20.1
N$35
  Bottom 0.406: R37.P$2 72.47,90.27 JACK_OUT_2.P$1
N$36
  Top 0.305: R38.P$2 78.19,78.76 76.06,80.89 73.34,80.89 72.61,81.61 72.61,84.33 JACK_OUT_3.P$1
N$37
  Bottom 0.305: JACK_OUT_4.P$1 72.39,72.96 R39.P$2
N$38
  Top 0.305: JACK_OUT_5.P$1 72.39,61.53 R40.P$2
N$39
  Top 0.305: JACK_OUT_6.P$1 72.39,50.1 R41.P$2
N$40
  Top 0.305: JACK_OUT_7.P$1 72.39,38.67 R42.P$2
N$41
  Top 0.406: JACK_OUT_8.P$1 72.47,25.42 76.28,21.61 R43.P$2
OUT0  (via drill 0.38)
  Top 0.305: v71.12,57.8 69.85,56.53 64.77,56.53 63.5,55.26 U$1.OUT_PIN1
  Bottom 0.305: v71.12,57.8 71.76,58.44 80.65,58.44 82.55,60.34 82.55,100.35 81.28,101.62 R36.P$1
OUT1
  Bottom 0.406: U$1.OUT_PIN2 62.23,59.07 72.39,59.07 74.93,61.61 74.93,87.01 76.84,88.92 78.74,88.92 R37.P$1
OUT2
  Top 0.406: U$1.OUT_PIN3 62.87,62.25 62.87,77.96 64.3,79.39 71.76,79.39 R38.P$1
OUT3  (via drill 0.38)
  Top 0.406: R39.P$1 77.3,64.62 74.59,64.62 74.12,64.15 v64.14,64.15
  Bottom 0.406: v64.14,64.15 62.23,64.15 U$1.OUT_PIN4
OUT4  (via drill 0.38)
  Top 0.406: v73.66,62.88 74.3,62.25 74.3,58.44 76.84,55.9 R40.P$1
  Bottom 0.406: U$1.OUT_PIN5 64.44,65.42 65.57,64.29 72.26,64.29 v73.66,62.88
OUT5
  Top 0.406: R41.P$1 78.57,45.91 75.22,45.91 73.83,47.3 73.83,50.65 70.48,53.99 60.62,53.99 59.83,54.79 59.83,65.89 60.96,67.03 U$1.OUT_PIN6
OUT6
  Top 0.406: U$1.OUT_PIN7 62.23,71.77 62.23,78.15 64.06,79.98 71.74,79.98 71.84,80.08 76.04,80.08 80.07,76.05 80.35,76.05 82.6,73.8 82.6,34.89 80.75,33.04 R42.P$1
OUT7
  Top 0.406: U$1.OUT_PIN8 59.69,73.04 55.25,68.6 55.25,64.15 57.15,62.25 57.15,56.53 62.23,51.45 69.85,51.45 70.48,50.82 70.48,23.51 R43.P$1
POT_IN1
  Top 0.61: 0.1 35.52,78.16 C4.2
  Bottom 0.406: R12.P$1 31.75,81.3 32.39,81.93 34.23,81.93 0.1
POT_IN3
  Top 0.61: R1.P$1 36.83,70.5 34.89,68.56 34.89,60.96 2.1
  Bottom 0.61: 2.1 35.56,60.29 C2.2
POT_IN4
  Bottom 0.61: C1.2 55.88,60.29 3.1 53.3,62.87 53.3,70.46 R5.P$1
POT_IN8
  Top 0.406: R23.P$1 55.84,32.36 7.1
  Bottom 0.61: 7.1 55.84,17.2 C8.2
REG_5V
  Bottom 0.406: U1.OUT 26.04,105.43 24.76,104.16 19.05,104.16 11.43,104.16 J14.1
VOLTAGE_SELECT_OUTPUT
  Bottom 0.61: 11.08,90.19 J16.2 11.08,90.19 | 11.08,90.19 5.39,95.88 JACK_IN_2.P$2 JACK_IN_1.P$2 | 11.08,90.19 5.39,84.49 JACK_IN_3.P$2 JACK_IN_4.P$2 5.39,63.46 4.08,62.15 4.08,57.53 J9.1 | J9.1 5.71,52.36 4.08,50.72 4.08,49.64 5.71,48.01 J10.1 | J10.1 5.71,40.93 4.08,39.29 4.08,38.21 5.71,36.58 J11.1 | J11.1 5.71,29.5 4.08,27.86 4.08,26.78 5.71,25.15 J12.1 J20.2 | J17.2 J9.1 | J18.2 J10.1 | J19.2 J11.1
ZENER_10V
  Top 0.406: ZENER.C 19.05,100.35 16.51,97.81 16.51,92.73 J16.3
  Bottom 0.406: R10.P$1 ZENER.C

### Text on the board
tPlace: PEPPER-REV1 / BELA.IO (c) 2019 | OUT | IN | 0 | 1 | 2 | 3 | 4 | 5 | 6 | 7 | C | GND
tNames: analog in 0 | analog out 0 | analog in 1 | analog out 1 | analog in 2 | analog out 2 | analog in 3 | analog out 3 | analog in 4 | analog out 4 | analog in 5 | analog out 5 | analog out 6 | analog in 6 | analog out 7 | analog in 7 | audio out L | audio in L | audio in R | FRONT | audio out R
bNames: 12V IN | GND | 5V OUT | +5V | 12V with regulator | +12V | GND | 5V straight from rack | GND | GND | 3V3 to pots | -12V | red | stripe | 10V to pots from rack | digital | analog | analog | digital | analog | analog | digital | analog | analog | digital | analog | analog | 3V3 | SCL | SDA | GND | 3V3 | SCL | SDA | GND | BACK